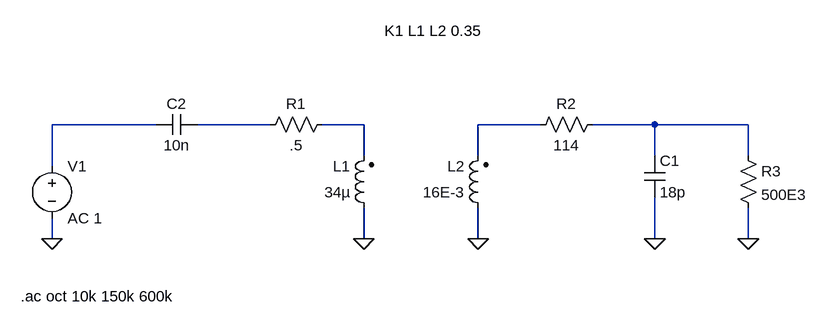
[diagram p0: schematic tesla_coil_freq.asc]
tesla_coil_freq.asc, the LTspice schematic file:
Version 4
SHEET 1 884 680
WIRE -160 96 -320 96
WIRE 16 96 -96 96
WIRE 160 96 96 96
WIRE 432 96 336 96
WIRE 608 96 512 96
WIRE 752 96 608 96
WIRE 160 144 160 96
WIRE 336 144 336 96
WIRE 608 144 608 96
WIRE 752 144 752 96
WIRE -320 160 -320 96
WIRE -320 272 -320 240
WIRE 160 272 160 224
WIRE 336 272 336 224
WIRE 608 272 608 208
WIRE 752 272 752 224
FLAG 608 272 0
FLAG 336 272 0
FLAG 160 272 0
FLAG -320 272 0
FLAG 752 272 0
SYMBOL ind2 176 240 R180
WINDOW 0 36 80 Left 2
WINDOW 3 36 40 Left 2
SYMATTR InstName L1
SYMATTR Value 34µ
SYMATTR Type ind
SYMBOL ind2 352 240 R180
WINDOW 0 36 80 Left 2
WINDOW 3 36 40 Left 2
SYMATTR InstName L2
SYMATTR Value 16E-3
SYMATTR Type ind
SYMBOL res 112 80 R90
WINDOW 0 0 56 VBottom 2
WINDOW 3 32 56 VTop 2
SYMATTR InstName R1
SYMATTR Value .5
SYMBOL res 528 80 R90
WINDOW 0 0 56 VBottom 2
WINDOW 3 32 56 VTop 2
SYMATTR InstName R2
SYMATTR Value 114
SYMBOL cap -96 80 R90
WINDOW 0 0 32 VBottom 2
WINDOW 3 32 32 VTop 2
SYMATTR InstName C2
SYMATTR Value 10n
SYMBOL cap 592 144 R0
SYMATTR InstName C1
SYMATTR Value 18p
SYMBOL voltage -320 144 R0
SYMATTR InstName V1
SYMATTR Value AC 1
SYMBOL res 736 128 R0
SYMATTR InstName R3
SYMATTR Value 500E3
TEXT 192 -48 Left 2 !K1 L1 L2 0.35
TEXT -368 360 Left 2 !.ac oct 10k 150k 600k

The netlist it stands for:
* tesla_coil_freq.asc
L1 0 N003 34µ
L2 0 N004 16E-3
R1 N003 N002 .5
R2 N005 N004 114
C2 N002 N001 10n
C1 N005 0 18p
V1 N001 0 AC 1
R3 N005 0 500E3
K1 L1 L2 0.35
.ac oct 10k 150k 600k
.backanno
.end